# EAGLE design Ad8232_placa_V3_SPlanoTerra (EAGLE 9.6.2)
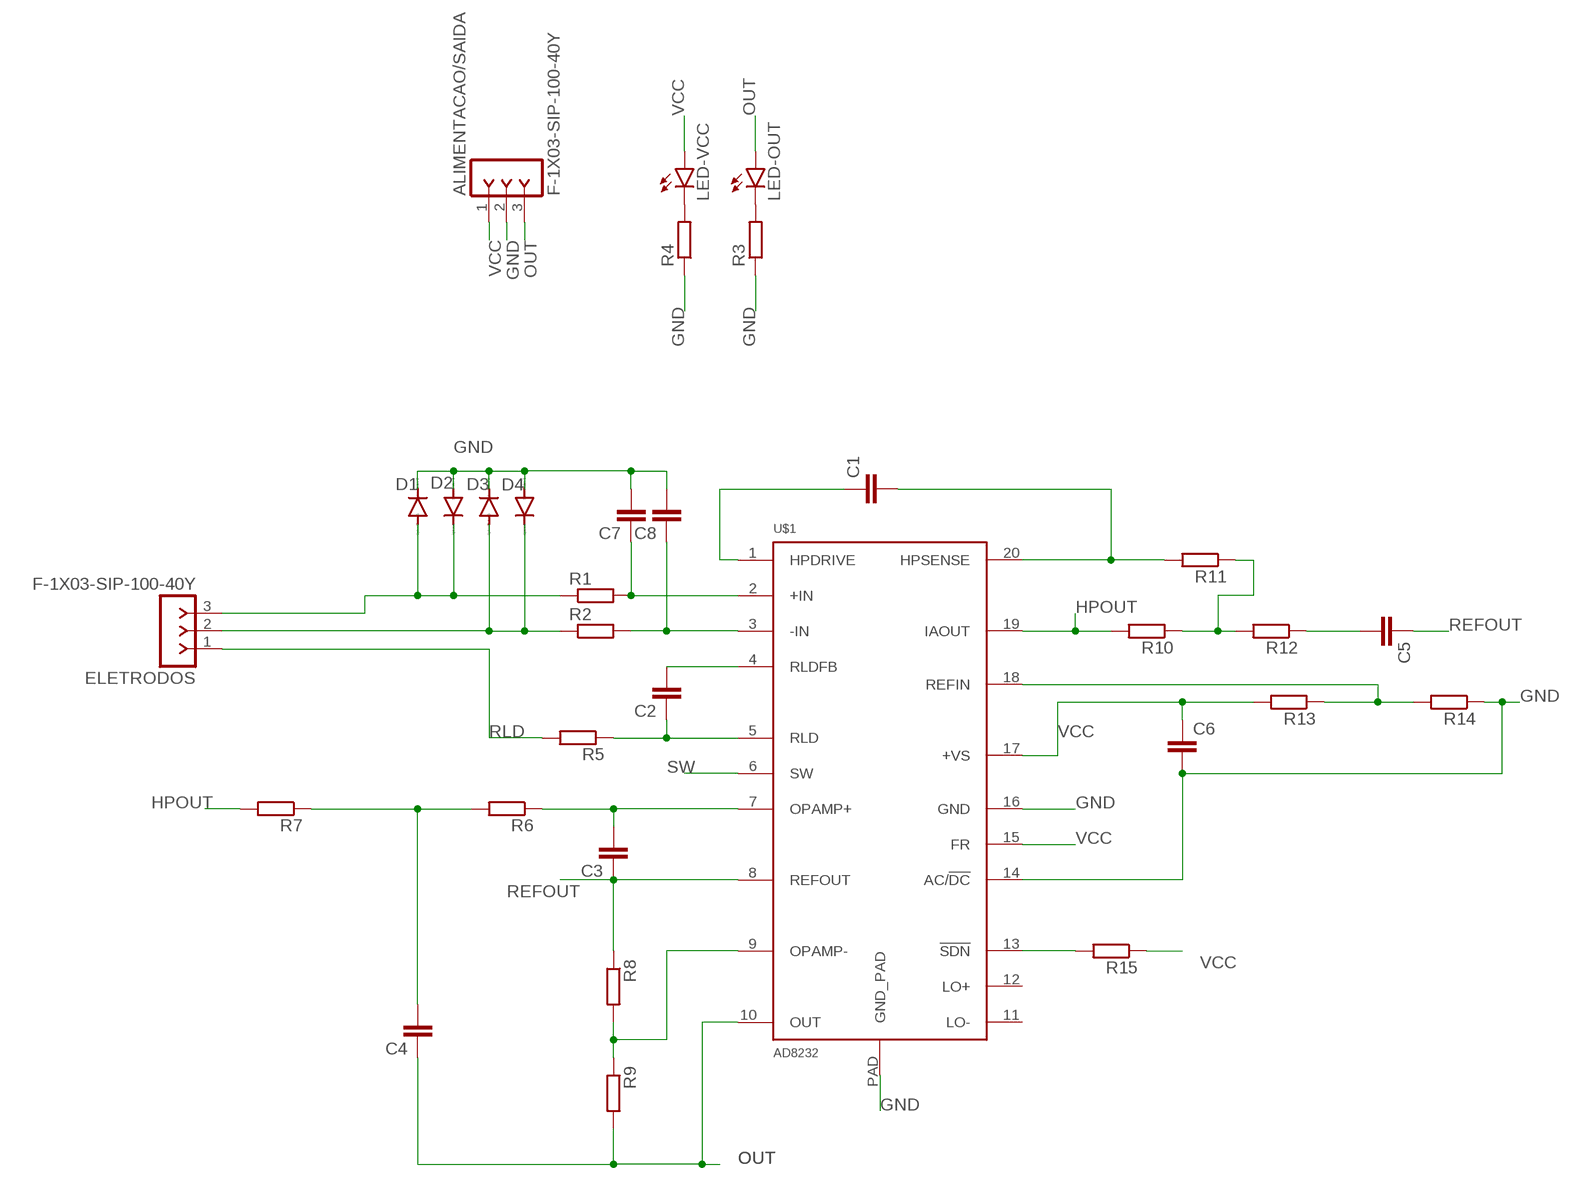
[diagram p0: schematic, sheet 1]

## Parts
ALIMENTACAO/SAIDA  F-1X03-SIP-100-40Y  [SIP-100-03-40Y]
C1  C-EUC0805  [C0805]
C2  C-EUC0805  [C0805]
C3  C-EUC0805  [C0805]
C4  C-EUC0805  [C0805]
C5  C-EUC0805  [C0805]
C6  C-EUC0805  [C0805]
C7  C-EUC0805  [C0805]
C8  C-EUC0805  [C0805]
D1  DIODE-MINIMELF  [MINIMELF]
D2  DIODE-MINIMELF  [MINIMELF]
D3  DIODE-MINIMELF  [MINIMELF]
D4  DIODE-MINIMELF  [MINIMELF]
ELETRODOS  F-1X03-SIP-100-40Y  [SIP-100-03-40Y]
LED-OUT  LEDCHIPLED_0603  [CHIPLED_0603]
LED-VCC  LEDCHIPLED_0603  [CHIPLED_0603]
R1  R-EU_R0805  [R0805]
R2  R-EU_R0805  [R0805]
R3  R-EU_R0805  [R0805]
R4  R-EU_R0805  [R0805]
R5  R-EU_R0805  [R0805]
R6  R-EU_R0805  [R0805]
R7  R-EU_R0805  [R0805]
R8  R-EU_R0805  [R0805]
R9  R-EU_R0805  [R0805]
R10  R-EU_R0805  [R0805]
R11  R-EU_R0805  [R0805]
R12  R-EU_R0805  [R0805]
R13  R-EU_R0805  [R0805]
R14  R-EU_R0805  [R0805]
R15  R-EU_R0805  [R0805]
U$1  AD8232  [LFCSP_20]

## Nets
GND: ALIMENTACAO/SAIDA.2 C6.2 C7.2 C8.2 D1.C D2.A D3.C D4.A R3.1 R4.1 R14.1 U$1.14(AC/!DC) U$1.16(GND) U$1.PAD(GND_PAD)
HPOUT: R7.2 R10.2 U$1.19(IAOUT)
N$1: C1.1 U$1.1(HPDRIVE)
N$2: C1.2 R11.2 U$1.20(HPSENSE)
N$3: C7.1 R1.2 U$1.2(+IN)
N$4: C8.1 R2.2 U$1.3(-IN)
N$5: D1.A D2.C ELETRODOS.3 R1.1
N$6: D3.A D4.C ELETRODOS.2 R2.1
N$7: C2.2 U$1.4(RLDFB)
N$8: C2.1 R5.1 U$1.5(RLD)
N$9: C3.2 R6.1 U$1.7(OPAMP+)
N$10: R13.1 R14.2 U$1.18(REFIN)
N$11: R8.2 R9.1 U$1.9(OPAMP-)
N$12: LED-OUT.C R3.2
N$13: R10.1 R11.1 R12.2
N$14: C4.2 R6.2 R7.1
N$15: LED-VCC.C R4.2
N$16: R15.2 U$1.13(!SDN)
OUT: ALIMENTACAO/SAIDA.3 C4.1 LED-OUT.A R9.2 U$1.10(OUT)
REFOUT: C3.1 C5.1 R8.1 U$1.8(REFOUT)
RLD: ELETRODOS.1 R5.2
SW: C5.2 R12.1 U$1.6(SW)
VCC: ALIMENTACAO/SAIDA.1 C6.1 LED-VCC.A R13.2 R15.1 U$1.15(FR) U$1.17(+VS)
Unconnected: U$1.11(LO-) U$1.12(LO+)

## Library data of the parts
ALIMENTACAO/SAIDA ELETRODOS = con-headers-jp:F-1X03-: FEMALE HEADER
C1-C8 = rcl:C-EU: CAPACITOR, European symbol
D1-D4 = diode:DIODE-: DIODE
LED-OUT LED-VCC = led:LED: LED OSRAM: - CHIPLED LG R971, LG N971, LY N971, LG Q971, LY Q971, LO R971, LY R971 LH N974, LH R974 LS Q976, LO Q976, LY Q976 LO Q996 - Hyper CHIPLED LW Q18S LB Q993, LB Q99A, LB R99A - SideLED LS A670, LO A670, LY A670, LG A670, LP A670 LB A673, LV A673, LT A673, LW A673 LH A674 LY A675 LS A676, LA A676, LO A676, LY A676, LW A676 LS A679, LY A679, LG A679 - Hyper Micro SIDELED® LS Y876, LA Y876, LO Y876, LY Y876 LT Y87S - SmartLED LW L88C, LW L88S LB L89C, LB L89S, LG L890 LS L89K, LO L89K, LY L89K LS L896, LA L896, LO L896, LY L896 - TOPLED LS T670, LO T670, LY T670, LG T670, LP T670 LSG T670, LSP T670, LSY T670, LOP T670, LYG T670 LG T671, LOG T671, LSG T671 LB T673, LV T673, LT T673, LW T673 LH T674 LS T676, LA T676, LO T676, LY T676, LB T676, LH T676, LSB T676, LW T676 LB T67C, LV T67C, LT T67C, LS T67K, LO T67K, LY T67K, LW E67C LS E67B, LA E67B, LO E67B, LY E67B, LB E67C, LV E67C, LT E67C LW T67C LS T679, LY T679, LG T679 LS T770, LO T770, LY T770, LG T770, LP T770 LB T773, LV T773, LT T773, LW T773 LH T774 LS E675, LA E675, LY E675, LS T675 LS T776, LA T776, LO T776, LY T776, LB T776 LHGB T686 LT T68C, LB T68C - Hyper Mini TOPLED® LB M676 - Mini TOPLED Santana® LG M470 LS M47K, LO M47K, LY M47K Source: http://www.osram.convergy.de LUXEON: - LUMILED® LXK2-PW12-R00, LXK2-PW12-S00, LXK2-PW14-U00, LXK2-PW14-V00 LXK2-PM12-R00, LXK2-PM12-S00, LXK2-PM14-U00 LXK2-PE12-Q00, LXK2-PE12-R00, LXK2-PE12-S00, LXK2-PE14-T00, LXK2-PE14-U00 LXK2-PB12-K00, LXK2-PB12-L00, LXK2-PB12-M00, LXK2-PB14-N00, LXK2-PB14-P00, LXK2-PB14-Q00 LXK2-PR12-L00, LXK2-PR12-M00, LXK2-PR14-Q00, LXK2-PR14-R00 LXK2-PD12-Q00, LXK2-PD12-R00, LXK2-PD12-S00 LXK2-PH12-R00, LXK2-PH12-S00 LXK2-PL12-P00, LXK2-PL12-Q00, LXK2-PL12-R00 Source: www.luxeon.com KINGBRIGHT: KA-3528ASYC Source: www.kingbright.com
R1-R15 = rcl:R-EU_: RESISTOR, European symbol
U$1 = AD8232:AD8232: Check prices <https://pricing.snapeda.com/parts/AD8232/Analog%20Devices/view-part?ref=eda>; AVAILABILITY: Not in stock; DESCRIPTION: AD8232 Sensor Signal Conditioner Interface Evaluation Board; MF: Analog Devices; MP: AD8232; PACKAGE: LFCSP-20 Analog Devices; PRICE: None

## Board
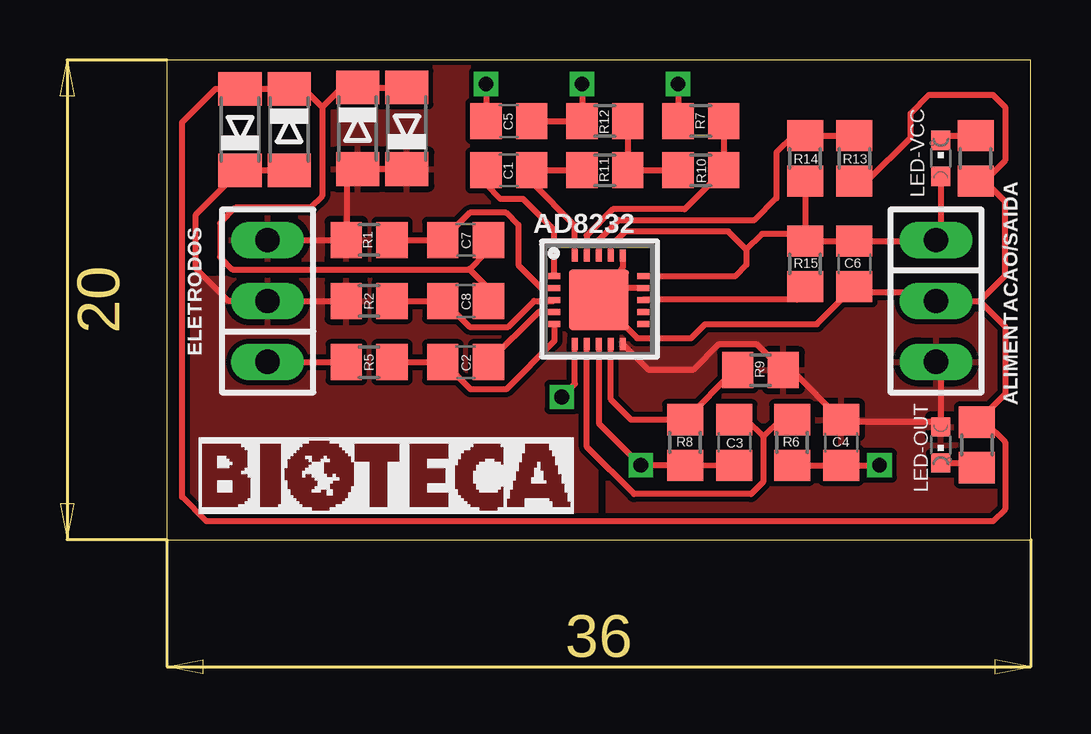
[diagram p1: board, top side]
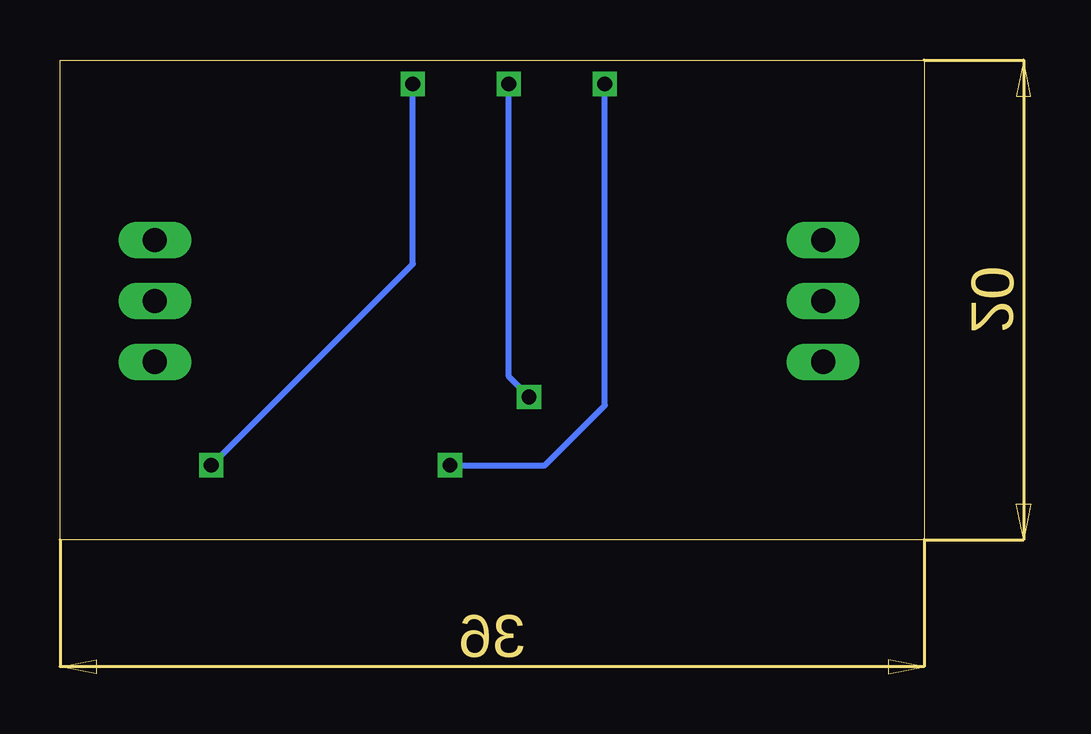
[diagram p2: board, bottom side, seen from below]

Size 36 x 20 mm. Coordinates in mm from the lower left corner, seen from the top.
Outline: 0,0 36,0 36,20 0,20 0,0
Copper layers (1*16): Top 0.035mm / dielectric 1.5mm / Bottom 0.035mm
Design rules "default *": minimum track width 10mil, minimum drill 24mil, track to track 8mil, track to pad 8mil, pad to pad 8mil, via to via 8mil, smd to smd 8mil, copper to edge 8mil, drill to drill 8mil, minimum pad ring 10mil, minimum via ring 8mil, stop-mask expansion 4mil, vias tented up to drill 0mil, thermal gap 10mil

### Footprints (pad centres in the part's own frame; a part is rotated, then mirrored left to right if it is on the bottom)
SIP-100-03-40Y = drill 1.016 long: 1 -2.54,0; 2 0,0; 3 2.54,0
C0805 = smd 1.3 x 1.5: 1 -0.95,0; 2 0.95,0
MINIMELF = smd 1.4 x 1.8: A 1.7,0; C -1.7,0
CHIPLED_0603 = smd 0.8 x 0.8: A 0,-0.75; C 0,0.75
R0805 = smd 1.3 x 1.5: 1 -0.95,0; 2 0.95,0
LFCSP_20 = smd 0.5 x 0.25: 1 -1.85,1; 2 -1.85,0.5; 3 -1.85,0; 4 -1.85,-0.5; 5 -1.85,-1; 11 1.85,-1; 12 1.85,-0.5; 13 1.85,0; 14 1.85,0.5; 15 1.85,1 | smd 0.25 x 0.5: 6 -1,-1.85; 7 -0.5,-1.85; 8 0,-1.85; 9 0.5,-1.85; 10 1,-1.85; 16 1,1.85; 17 0.5,1.85; 18 0,1.85; 19 -0.5,1.85; 20 -1,1.85 | smd 2.5 x 2.5: PAD 0,0

### Placement (x,y rotation side)
ALIMENTACAO/SAIDA  32.05,9.95 270 top
C1  14.25,15.4 0 top
C2  12.45,7.4 0 top
C3  23.65,4.05 90 top
C4  28.1,4.05 270 top
C5  14.25,17.45 0 top
C6  28.65,11.5 270 top
C7  12.45,12.5 0 top
C8  12.45,9.95 0 top
D1  7.95,17.15 270 top
D2  10,17.15 90 top
D3  5.1,17.1 270 top
D4  3.05,17.1 90 top
ELETRODOS  4.2,9.95 90 top
LED-OUT  32.25,3.95 180 top
LED-VCC  32.25,15.9 0 top
R1  8.43,12.5 0 top
R2  8.43,9.95 0 top
R3  33.75,3.95 270 top
R4  33.7,15.9 90 top
R5  8.43,7.4 180 top
R6  26.05,4.05 270 top
R7  22.25,17.45 0 top
R8  21.6,4.05 90 top
R9  24.74,7.07 0 top
R10  22.25,15.4 0 top
R11  18.25,15.4 180 top
R12  18.25,17.45 0 top
R13  26.6,15.9 270 top
R14  28.65,15.9 90 top
R15  26.6,11.5 270 top
U$1  18,10 0 top

### Tracks (layer width: path | path; a pad name or v marks a point on that pad's centre or on a via)
GND
  Top 0.254: C7.2 13.27,12.37 13.27,11.94 12.62,11.28 12.63,11.27 | C8.2 13.4,10.5 12.63,11.27 | U$1.14 18.5,10.5 U$1.PAD | U$1.16 19,11.38 18.38,10.38 U$1.PAD | U$1.PAD 19.6,8.4 21.84,8.4 22.43,8.99 27.09,8.99 C6.2 28.9,10.3 31.2,10.3 31.54,9.95 ALIMENTACAO/SAIDA.2 33.87,9.95 | 33.87,9.95 34.92,8.89 34.92,6.08 R3.1 34.09,4.9 34.92,4.06 34.92,1.27 34.42,0.76 1.65,0.76 0.64,1.78 0.64,17.4 2.03,18.8 D4.A D3.C 5.71,18.8 6.48,18.03 | 33.87,9.95 34.92,11.01 34.92,14.1 34.07,14.95 | 34.07,14.95 R4.1 | 6.48,18.03 7.29,18.85 D1.C D2.A | 6.48,18.03 6.48,14.33 5.98,13.84 2.86,13.84 2.22,13.2 2.22,11.78 2.73,11.27 12.63,11.27 | R14.1 29.17,14.95 30.99,16.76 30.99,17.78 31.75,18.54 34.42,18.54 34.92,18.03 34.92,15.8 34.07,14.95
HPOUT
  Top 0.254: R7.2 R10.2 21.58,13.78 18.59,13.78 17.5,12.69 U$1.19
N$1
  Top 0.254: U$1.1 16.15,12.9 14.85,14.2 13.9,14.2 13.3,14.8 C1.1
N$2
  Top 0.254: R11.2 C1.2 15.2,14.9 17,13.1 U$1.20
N$3
  Top 0.254: R1.2 C7.1 12.63,13.63 14.14,13.63 14.65,13.12 14.65,11.45 15.6,10.5 U$1.2
N$4
  Top 0.254: R2.2 C8.1 11.53,9.95 12.61,8.87 14.22,8.87 15.31,9.96 16.11,9.96 U$1.3
N$5
  Top 0.254: ELETRODOS.3 4.36,12.5 7.25,12.5 | 7.25,12.5 R1.1 | D2.C D1.A 7.5,15 7.5,12.75 7.25,12.5
  pour Top: -0.43,20.35 18.19,20.35 18.19,11.33 -0.43,11.33
N$6
  Top 0.254: R2.1 ELETRODOS.2 2.56,9.95 1.21,11.3 1.21,13.56 D4.C D3.A
  pour Top: -0.38,10.92 -0.38,-0.38 17.91,-0.38 17.91,10.92
N$7
  Top 0.254: C2.2 15.5,9.5 U$1.4
N$8
  Top 0.254: U$1.5 16.15,8.28 14.14,6.27 12.66,6.27 11.53,7.4 C2.1 R5.1
N$9
  Top 0.254: U$1.7 17.5,3.86 19.47,1.9 24.35,1.9 24.85,2.4 24.85,4.3 | C3.2 24.15,5 24.85,4.3 | R6.1 25.55,5 24.85,4.3
N$10
  Top 0.254: R14.2 R13.1 26.1,16.85 25.4,16.15 25.4,14.23 24.49,13.32 18.83,13.32 18,12.49 U$1.18
N$11
  Top 0.254: U$1.9 18.5,5.85 19.35,5 R8.2 23.67,7.07 R9.1
N$12
  Top 0.254: LED-OUT.C 33.55,3.2 R3.2
N$13
  Top 0.254: R12.2 R11.1 R10.1
N$14  (via drill 0.61)
  Top 0.254: R6.2 C4.2 v29.7,3.1 | v21.3,19 R7.1
  Bottom 0.254: v29.7,3.1 21.3,11.5 v21.3,19
N$15
  Top 0.254: LED-VCC.C 32.45,16.85 R4.2
N$16
  Top 0.254: U$1.13 26.26,10.01 26.81,10.55 R15.2
OUT
  Top 0.254: ALIMENTACAO/SAIDA.3 32.25,7.28 LED-OUT.A 32.05,4.9 28.2,4.9 C4.1 26.03,7.07 R9.2 25.66,7.07 24.58,8.15 23,8.15 21.95,7.1 20.05,7.1 U$1.10
  pour Top: 18.54,-0.76 18.41,-0.76 18.41,10.16 36.7,10.16 36.7,-0.51 36.7,-0.76
REFOUT  (via drill 0.61)
  Top 0.254: C3.1 21.64,3.08 R8.1 v19.75,3.1 18,4.85 U$1.8 | v13.3,19 C5.1
  Bottom 0.254: v19.75,3.1 15.8,3.1 13.3,5.6 v13.3,19
RLD
  Top 0.254: ELETRODOS.1 R5.2
SW  (via drill 0.61)
  Top 0.254: C5.2 R12.1 v17.3,19 | v16.46,5.95 17,6.49 U$1.6
  Bottom 0.254: v16.46,5.95 17.3,6.79 v17.3,19
VCC
  Top 0.254: R13.2 R15.1 | R15.1 C6.1 32.01,12.45 ALIMENTACAO/SAIDA.1 32.25,12.69 LED-VCC.A | U$1.17 18.5,12.25 19.1,12.85 23.4,12.85 24.15,12.1 | U$1.15 23.7,11 24.15,11.45 24.15,12.1 | 24.15,12.1 24.8,12.75 26.3,12.75 R15.1